# EAGLE design UNO florist automata V1.10 (EAGLE 9.3.1)
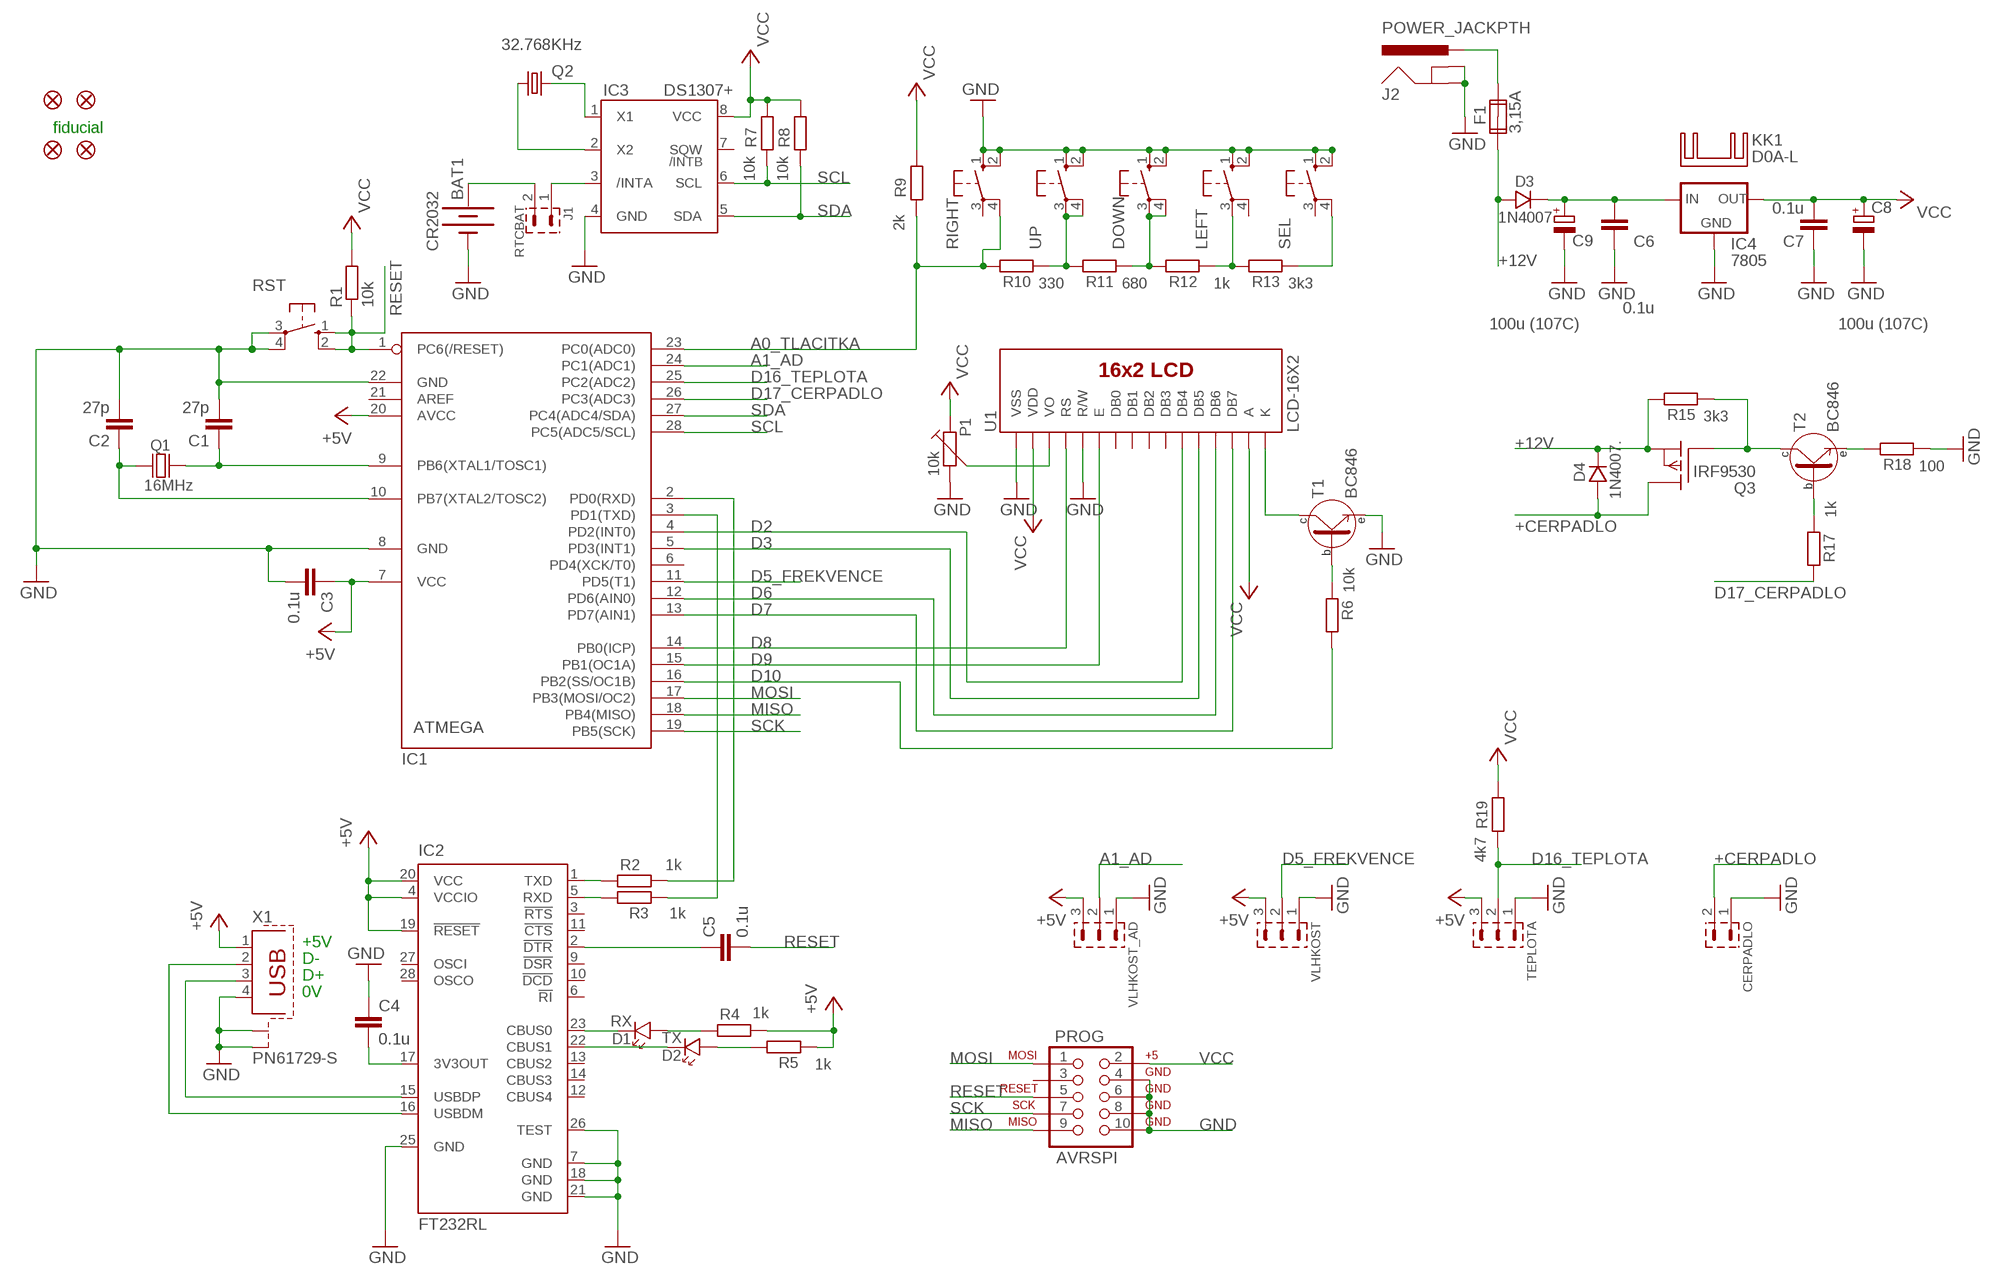
[diagram p0: schematic, sheet 1]

## Parts
BAT1  CR2032  BATTERY20PTH  [BATTCOM_20MM_PTH]
C1  27p  C-EUC1206  [C1206]
C2  27p  C-EUC1206  [C1206]
C3  0.1u  C-EUC1206  [C1206]
C4  0.1u  C-EUC1206  [C1206]
C5  0.1u  C-EUC1206  [C1206]
C6  0.1u  C-EUC1206  [C1206]
C7  0.1u  C-EUC1206  [C1206]
C8  100u (107C)  CPOL-EUC/6032-28W  [C/6032-28W]
C9  100u (107C)  CPOL-EUC/6032-28W  [C/6032-28W]
CERPADLO  PSH02-02P  [PSH02-02P]
D1  RX  LED_1206  [P1206]
D2  TX  LED_1206  [P1206]
D3  1N4007.  [SM-1]
D4  1N4007.  [SM-1]
DOWN  10-XX  [B3F-10XX]
F1  3,15A  FUSE2P  [FUSE1]
FID1  FIDUCIAL1.5X3  [FIDUCIAL-1.5X3]
FID2  FIDUCIAL1.5X3  [FIDUCIAL-1.5X3]
FID3  FIDUCIAL1.5X3  [FIDUCIAL-1.5X3]
FID4  FIDUCIAL1.5X3  [FIDUCIAL-1.5X3]
IC1  ATMEGA  MEGA8-P  [DIL28-3]
IC2  FT232RL  [SSOP28]
IC3  DS1307+  DS1337S+  [SO08]
IC4  7805  78XXL  [78XXL]
J1  RTCBAT  S1G2_JUMP  [S1G2_JUM]
J2  POWER_JACKPTH  [POWER_JACK_PTH]
KK1  D0A-L  [D02A-L]
LEFT  10-XX  [B3F-10XX]
P1  10k  TRIMRPT10V  [PT10V]
PROG  AVRSPI  AVR_SPI_PROG2LOCK  [2X5-SHROUDED_LOCK]
Q1  16MHz  Q_HC-49U  [HC-49U]
Q2  32.768KHz  CRYSTALTC38H  [TC38H]
Q3  IRF9530  [TO220]
R1  10k  R-EU_M1206  [M1206]
R2  1k  R-EU_M1206  [M1206]
R3  1k  R-EU_M1206  [M1206]
R4  1k  R-EU_M1206  [M1206]
R5  1k  R-EU_M1206  [M1206]
R6  10k  R-EU_M1206  [M1206]
R7  10k  R-EU_M1206  [M1206]
R8  10k  R-EU_M1206  [M1206]
R9  2k  R-EU_M1206  [M1206]
R10  330  R-EU_M1206  [M1206]
R11  680  R-EU_M1206  [M1206]
R12  1k  R-EU_M1206  [M1206]
R13  3k3  R-EU_M1206  [M1206]
R15  3k3  R-EU_M1206  [M1206]
R17  1k  R-EU_M1206  [M1206]
R18  100  R-EU_M1206  [M1206]
R19  4k7  R-EU_M1206  [M1206]
RIGHT  10-XX  [B3F-10XX]
RST  10-XX  [B3F-10XX]
SEL  10-XX  [B3F-10XX]
T1  BC846  [SOT-23]
T2  BC846  [SOT-23]
TEPLOTA  PSH02-03P  [PSH02-03P]
U1  LCD-16X2  LCD-16X2NOSILK  [LCD-16X2_NOSILK]
UP  10-XX  [B3F-10XX]
VLHKOST  PSH02-03P  [PSH02-03P]
VLHKOST_AD  PSH02-03P  [PSH02-03P]
X1  PN61729-S  [PN61729-S]

## Nets
+12V: D3.A D4.K F1.1A Q3.3(S) R15.2
+CERPADLO: CERPADLO.2 D4.A Q3.2(D)
A: IC3.2(X2) Q2.1
A0_TLACITKA: IC1.23(PC0(ADC0)) R9.1 R10.2 RIGHT.4(P1)
A1_AD: IC1.24(PC1(ADC1)) VLHKOST_AD.2
D2: IC1.4(PD2(INT0)) U1.11(DB4)
D3: IC1.5(PD3(INT1)) U1.12(DB5)
D5_FREKVENCE: IC1.11(PD5(T1)) VLHKOST.2
D6: IC1.12(PD6(AIN0)) U1.13(DB6)
D7: IC1.13(PD7(AIN1)) U1.14(DB7)
D8: IC1.14(PB0(ICP)) U1.4(RS)
D9: IC1.15(PB1(OC1A)) U1.6(E)
D10: IC1.16(PB2(SS/OC1B)) R6.2
D16_TEPLOTA: IC1.25(PC2(ADC2)) R19.1 TEPLOTA.2
D17_CERPADLO: IC1.26(PC3(ADC3)) R17.2
GND: BAT1.2(-) C1.2 C2.2 C3.2 C4.1 C6.1 C7.1 C8.- C9.- CERPADLO.1 DOWN.1(S) DOWN.2(S1) IC1.8(GND) IC1.22(GND) IC2.7(GND) IC2.18(GND) IC2.21(GND) IC2.25(GND) IC2.26(TEST) IC3.4(GND) IC4.GND J2.GND J2.GNDBREAK LEFT.1(S) LEFT.2(S1) P1.2 PROG.4 PROG.6 PROG.8 PROG.10 R18.1 RIGHT.1(S) RIGHT.2(S1) RST.3(P) RST.4(P1) SEL.1(S) SEL.2(S1) T1.2(E) TEPLOTA.1 U1.1(VSS) U1.5(R/W) UP.1(S) UP.2(S1) VLHKOST.1 VLHKOST_AD.1 X1.4 X1.S1 X1.S2
MISO: IC1.18(PB4(MISO)) PROG.9
MOSI: IC1.17(PB3(MOSI/OC2)) PROG.1
N$1: IC2.16(USBDM) X1.2
N$2: IC2.15(USBDP) X1.3
N$3: C4.2 IC2.17(3V3OUT)
N$4: IC2.1(TXD) R2.1
N$5: IC2.5(RXD) R3.2
N$6: IC1.2(PD0(RXD)) R2.2
N$7: IC1.3(PD1(TXD)) R3.1
N$8: C5.1 IC2.2(!DTR)
N$9: D1.K IC2.23(CBUS0)
N$10: D1.A R4.1
N$11: D2.K IC2.22(CBUS1)
N$12: D2.A R5.2
N$13: BAT1.1(+) J1.2
N$14: IC3.3(/INTA) J1.1
N$15: T1.3(C) U1.16(K)
N$18: R10.1 R11.2 UP.3(P) UP.4(P1)
N$19: DOWN.3(P) DOWN.4(P1) R11.1 R12.2
N$20: LEFT.3(P) R12.1 R13.2
N$21: R13.1 SEL.4(P1)
N$22: F1.2A J2.PWR
N$23: C1.1 IC1.9(PB6(XTAL1/TOSC1)) Q1.2
N$24: C6.2 C9.+ D3.K IC4.IN
N$25: R6.1 T1.1(B)
N$26: C2.1 IC1.10(PB7(XTAL2/TOSC2)) Q1.1
N$27: Q3.1(G) R15.1 T2.3(C)
N$28: R18.2 T2.2(E)
N$29: R17.1 T2.1(B)
N$31: P1.3 U1.3(VO)
Q1: IC3.1(X1) Q2.2
RESET: C5.2 IC1.1(PC6(/RESET)) PROG.5 R1.1 RST.1(S) RST.2(S1)
SCK: IC1.19(PB5(SCK)) PROG.7
SCL: IC1.28(PC5(ADC5/SCL)) IC3.6(SCL) R7.1
SDA: IC1.27(PC4(ADC4/SDA)) IC3.5(SDA) R8.1
VCC: C3.1 C7.2 C8.+ IC1.7(VCC) IC1.20(AVCC) IC2.4(VCCIO) IC2.19(!RESET) IC2.20(VCC) IC3.8(VCC) IC4.OUT P1.1 PROG.2 R1.2 R4.2 R5.1 R7.2 R8.2 R9.2 R19.2 TEPLOTA.3 U1.2(VDD) U1.15(A) VLHKOST.3 VLHKOST_AD.3 X1.1 ; supply symbol labelled +5V
Unconnected: F1.1B F1.2B IC1.6(PD4(XCK/T0)) IC1.21(AREF) IC2.3(!RTS) IC2.6(!RI) IC2.9(!DSR) IC2.10(!DCD) IC2.11(!CTS) IC2.12(CBUS4) IC2.13(CBUS2) IC2.14(CBUS3) IC2.27(OSCI) IC2.28(OSCO) IC3.7(SQW) LEFT.4(P1) PROG.3 RIGHT.3(P) SEL.3(P) U1.7(DB0) U1.8(DB1) U1.9(DB2) U1.10(DB3)

## Notes on the sheet
- fiducial
- +5V
- D-
- D+
- 0V

## Library data of the parts
BAT1 = SparkFun-Electromechanical:BATTERY: Battery Holders Various common sizes : AA, AAA, 18650 (PRT-12895), 20mm coin cell and 12mm coin cell. 20MM_4LEGS, BATT-10373
C1-C7 = rcl:C-EU: CAPACITOR, European symbol
C8 C9 = rcl:CPOL-EU: POLARIZED CAPACITOR, European symbol
CERPADLO = #PaJa_konektory:PSH02-02: Konektory se zamkem - vidlice - 2pin
D1 D2 = #PaJa_31:LED: LED - jednobarevna
D3 D4 = #PaJa_31:1N4007: Usmernovaci dioda - 1A, 1000V
DOWN LEFT RIGHT RST SEL UP = switch-omron-modified:10-XX: OMRON SWITCH
F1 = special:FUSE2P: FUSE 5 x 20 mm
FID1-FID4 = SparkFun-Retired:FIDUCIAL: Fiducial Alignment Points Various fiducial points for machine vision alignment.
IC1 = atmel:MEGA8-P: MICROCONTROLLER 8 Kbytes FLASH, 1 kbytes SRAM, 512 bytes EEPROM, USART, 4-channel 10 bit ADC, 2-channel 8 bit ADC Pin compatible with Atmega48, ATMega88, ATMega168 Source: avr.lbr
IC2 = ftdichip:FT232R: Source: http://www.ftdichip.com/Documents/DataSheets/DS_FT232R_v104.pdf; MPN: FT232RL; OC_FARNELL: 1146032; OC_NEWARK: 91K9918
IC3 = #PaJa_31:DS1337: RTC - obvod realneho casu (ekviv. DS1307)
IC4 = v-reg:78XXL: VOLTAGE REGULATOR
J1 = #PaJa_konektory:S1G2_JUMP: Radove konektory - koliky - 2x
J2 = SparkFun-Connectors:POWER_JACK: Power Jack This is the standard 5.5mm barrel jack for power. The PTH is the most common, proven, reliable, footprint. The Slot footprint only works if the mill layer is transmitted to the PCB fab house so be warned. Mating wall wart : TOL-00298 (and others); PROD_ID: PRT-00119
KK1 = heatsink:D0A-L: HEATSINK distributor Schukat
P1 = #PaJa_31:TRIMR: Trimr
PROG = SparkFun-Connectors:AVR_SPI_PROG2: AVR 10-pin ICSP Header This is the standard AVR In Circuit Serial Programming header. Minimal, but includes pin one indicator. Works with standard Olimex programmers. Also look for the 6-pin reduced version. Spark Fun Electronics SKU: PRT-00778
Q1 = #PaJa_31:Q: Krystal HC-49 - 1MHz - 48MHz DT38 - Quartz (hodinovy) 32,768kHz
Q2 = crystal:CRYSTAL: CRYSTAL; OC_FARNELL: unknown; OC_NEWARK: unknown
Q3 = transistor-fet:IRF9530: P-Channel Enhancement MOSFET (HEXFET); -100V; -12A; 0,3Ohm
R1-R13 R15 R17-R19 = rcl:R-EU_: RESISTOR, European symbol
T1 T2 = #PaJa_31:BC846: SMD tranzistor - NPN - ekv. BC546
TEPLOTA VLHKOST VLHKOST_AD = #PaJa_konektory:PSH02-03: Konektory se zamkem - vidlice - 3pin
U1 = SparkFun-Displays:LCD-16X2: Standard text-only 16x2 parallel input LCD
X1 = con-berg:PN61729-S: BERG USB connector; OC_FARNELL: unknown; OC_NEWARK: unknown

## Board
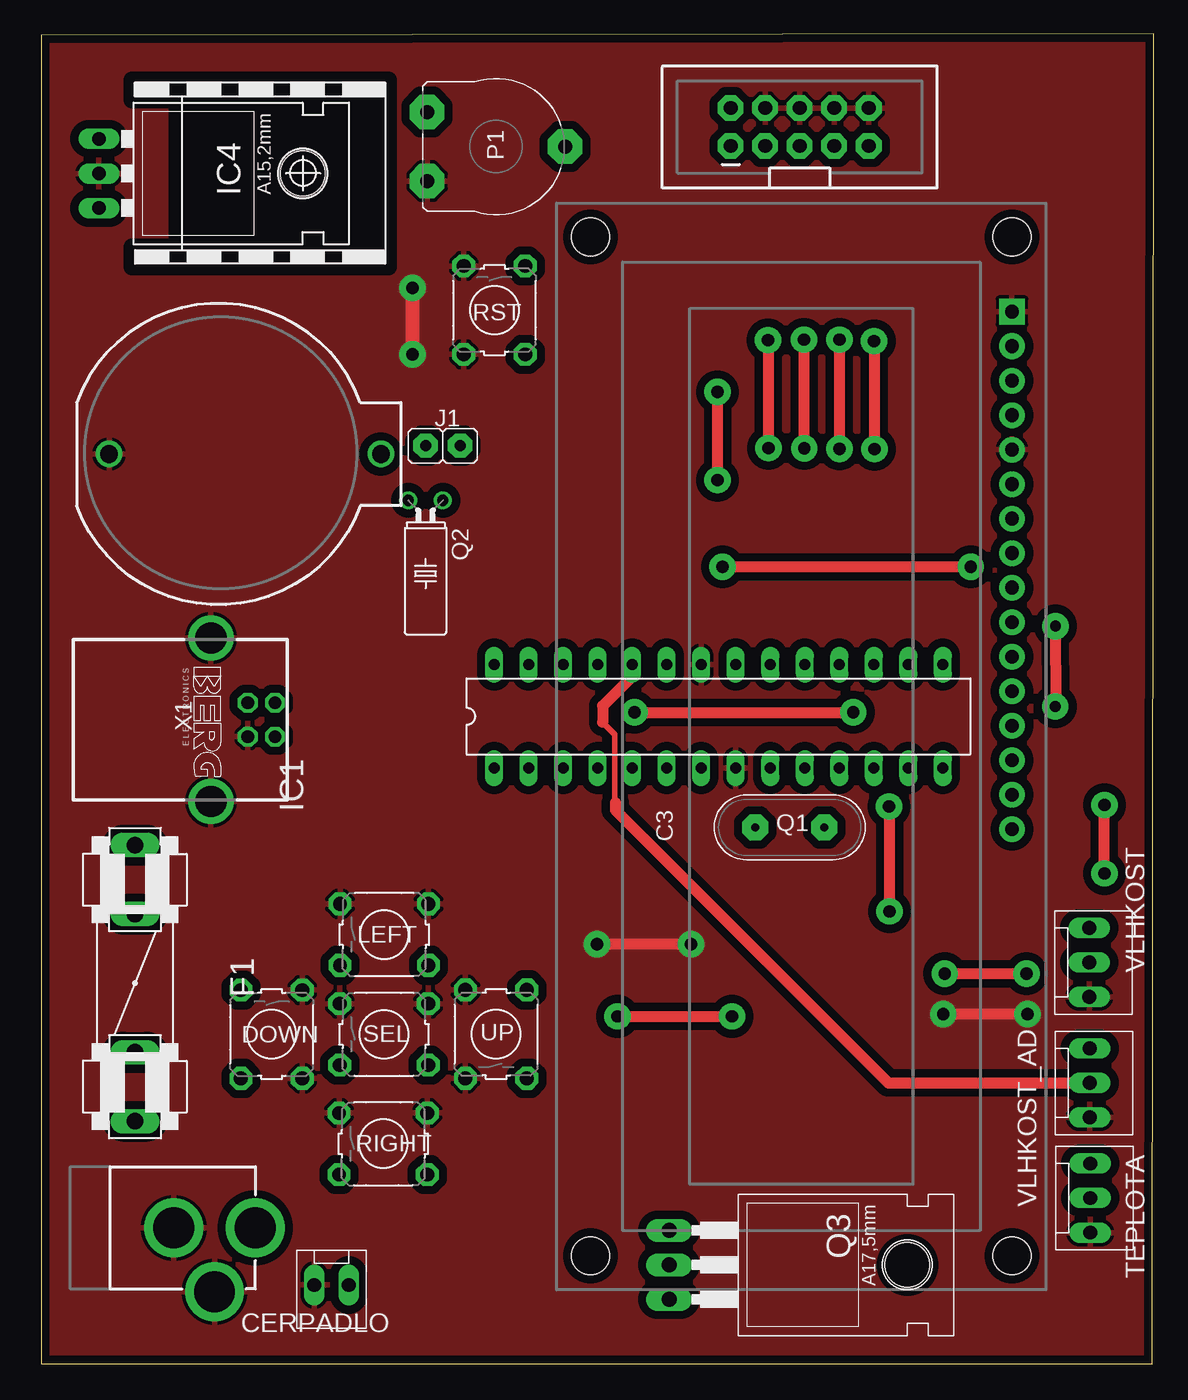
[diagram p1: board, top side]
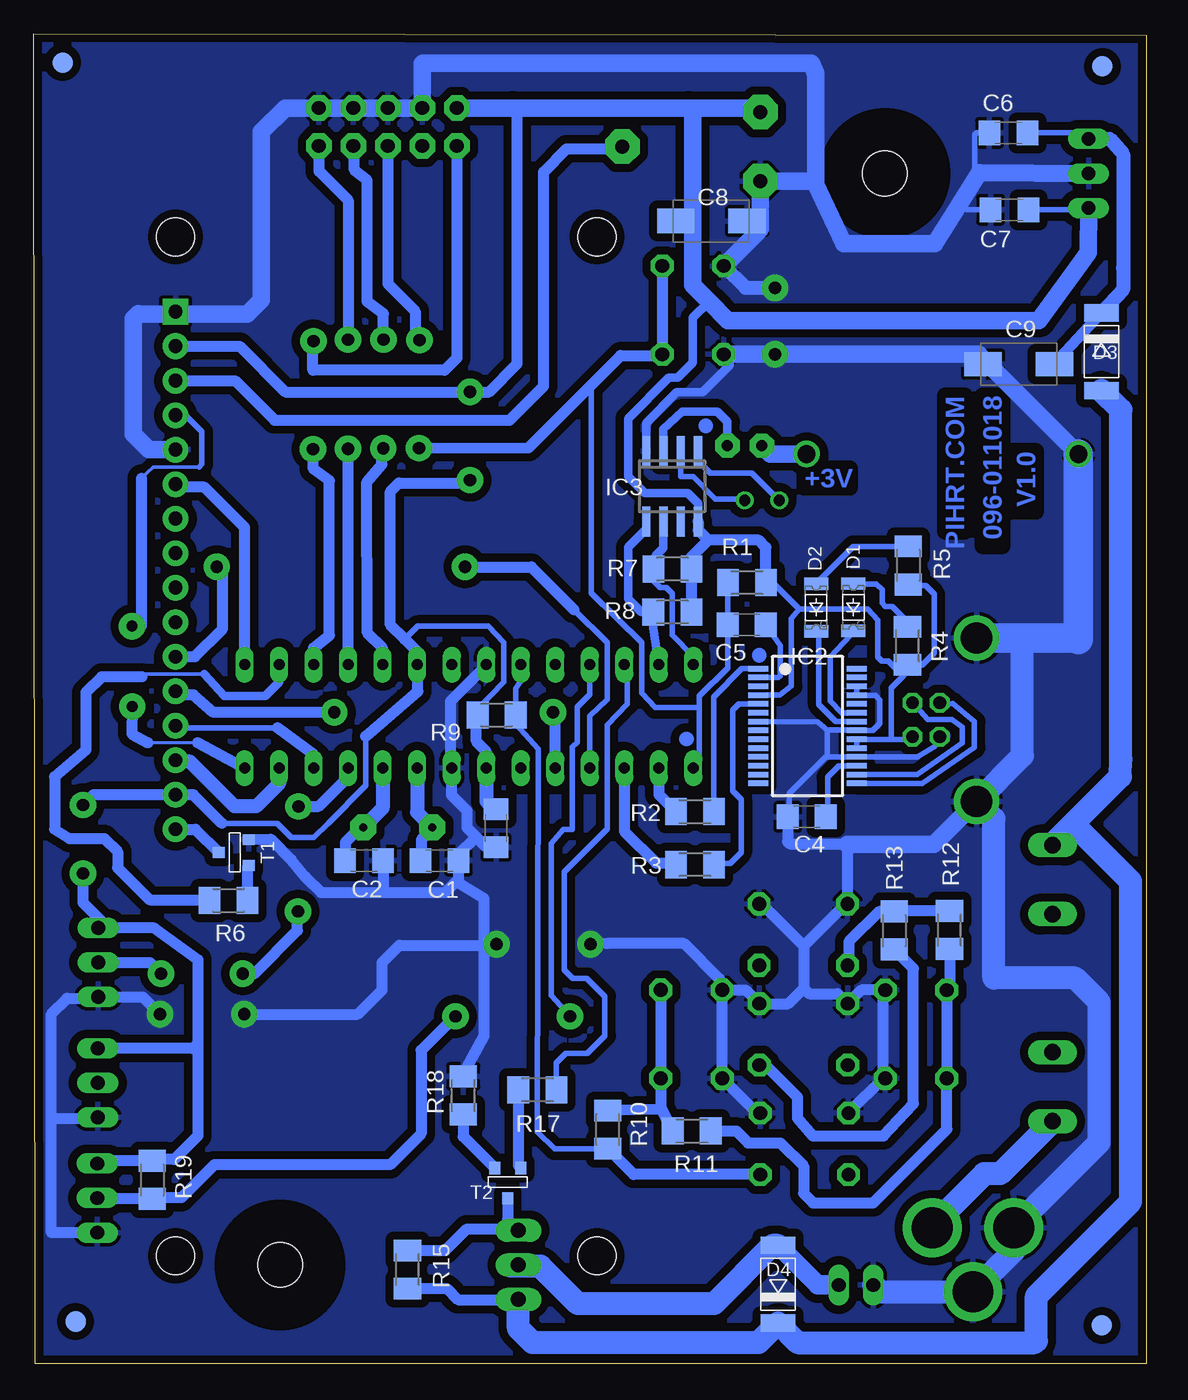
[diagram p2: board, bottom side, seen from below]

Size 81.85 x 97.9 mm. Coordinates in mm from the lower left corner, seen from the top.
Outline: 0.02,0.01 81.76,0 81.85,97.9 0,97.8 0.02,0.01
Copper layers (1*16): Top 0.035mm / dielectric 1.5mm / Bottom 0.035mm
Design rules "default": minimum track width 5mil, minimum drill 12mil, track to track 5mil, track to pad 5mil, pad to pad 5mil, via to via 5mil, smd to smd 0mil, copper to edge 10mil, drill to drill 10mil, minimum pad ring 10mil, minimum via ring 6mil, stop-mask expansion 2mil, vias tented up to drill 25mil, thermal gap 10mil

### Footprints (pad centres in the part's own frame; a part is rotated, then mirrored left to right if it is on the bottom)
BATTCOM_20MM_PTH = drill 1.3: 1 11.85,0; 2 -8.15,0
C1206 = smd 1.6 x 1.8: 1 -1.4,0; 2 1.4,0
C/6032-28W = smd 2.75 x 1.8: + 2.625,0; - -2.625,0
PSH02-02P = drill 1.016 pad 1.422 long: 1 -1.27,0; 2 1.27,0
P1206 = smd 0.914 x 1.778: A -1.905,0; K 1.587,0
SM-1 = smd 1.27 x 2.54: A 2.857,0; K -2.857,0
B3F-10XX = drill 1.016 pad 1.676 octagon: 1 -3.251,2.261; 2 3.251,2.261; 3 -3.251,-2.261; 4 3.251,-2.261
FUSE1 = drill 1.194 long: 1A -10.16,0; 1B -5.08,0; 2A 10.16,0; 2B 5.08,0
FIDUCIAL-1.5X3 = smd 1.5 x 1.5: 1 0,0
DIL28-3 = drill 0.813 long: 1 -16.51,-3.81; 2 -13.97,-3.81; 3 -11.43,-3.81; 4 -8.89,-3.81; 5 -6.35,-3.81; 6 -3.81,-3.81; 7 -1.27,-3.81; 8 1.27,-3.81; 9 3.81,-3.81; 10 6.35,-3.81; 11 8.89,-3.81; 12 11.43,-3.81; 13 13.97,-3.81; 14 16.51,-3.81; 15 16.51,3.81; 16 13.97,3.81; 17 11.43,3.81; 18 8.89,3.81; 19 6.35,3.81; 20 3.81,3.81; 21 1.27,3.81; 22 -1.27,3.81; 23 -3.81,3.81; 24 -6.35,3.81; 25 -8.89,3.81; 26 -11.43,3.81; 27 -13.97,3.81; 28 -16.51,3.81
SSOP28 = smd 0.4 x 1.5: 1 -4.225,-3.625; 2 -3.575,-3.625; 3 -2.925,-3.625; 4 -2.275,-3.625; 5 -1.625,-3.625; 6 -0.975,-3.625; 7 -0.325,-3.625; 8 0.325,-3.625; 9 0.975,-3.625; 10 1.625,-3.625; 11 2.275,-3.625; 12 2.925,-3.625; 13 3.575,-3.625; 14 4.225,-3.625; 15 4.225,3.625; 16 3.575,3.625; 17 2.925,3.625; 18 2.275,3.625; 19 1.625,3.625; 20 0.975,3.625; 21 0.325,3.625; 22 -0.325,3.625; 23 -0.975,3.625; 24 -1.625,3.625; 25 -2.275,3.625; 26 -2.925,3.625; 27 -3.575,3.625; 28 -4.225,3.625
SO08 = smd 0.6 x 2.2: 1 -1.905,-2.6; 2 -0.635,-2.6; 3 0.635,-2.6; 4 1.905,-2.6; 5 1.905,2.6; 6 0.635,2.6; 7 -0.635,2.6; 8 -1.905,2.6
78XXL = drill 1.016 long: GND 0,-3.81; IN -2.54,-3.81; OUT 2.54,-3.81 | hole 3.302: 0,11.176
S1G2_JUM = drill 0.813 pad 1.778 octagon: 1 -1.27,0; 2 1.27,0
POWER_JACK_PTH = drill 2.997 pad 4.318: GND 0,7.7; GNDBREAK 4.7,10.7; PWR 0,13.7
PT10V = drill 1.016 pad 2.54 octagon: 1 -2.54,-5.08; 2 2.54,-5.08; 3 0,5.08
2X5-SHROUDED_LOCK = drill 1.016 pad 1.88 octagon: 1 -1.397,5.08; 2 1.397,5.08; 3 -1.397,2.54; 4 1.397,2.54; 5 -1.397,0; 6 1.397,0; 7 -1.397,-2.54; 8 1.397,-2.54; 9 -1.397,-5.08; 10 1.397,-5.08
HC-49U = drill 0.61 pad 1.93 octagon: 1 -2.54,0; 2 2.54,0
TC38H = drill 0.813: 1 -1.27,0; 2 1.27,0
TO220 = drill 1.118 long: 1 -2.54,-6.35; 2 0,-6.35; 3 2.54,-6.35 | hole 3.302: 0,11.176
M1206 = smd 1.6 x 2: 1 -1.4,0; 2 1.4,0
SOT-23 = smd 0.787 x 0.889: 1 -0.953,-0.953; 2 0.953,-0.953; 3 0,1.27
PSH02-03P = drill 1.016 pad 1.422 long: 1 -2.54,0; 2 0,0; 3 2.54,0
LCD-16X2_NOSILK = drill 1.016 pad 1.88 square: 1 -32,15.5 | drill 1.016 pad 1.88: 2 -29.46,15.5; 3 -26.92,15.5; 4 -24.38,15.5; 5 -21.84,15.5; 6 -19.3,15.5; 7 -16.76,15.5; 8 -14.22,15.5; 9 -11.68,15.5; 10 -9.14,15.5; 11 -6.6,15.5; 12 -4.06,15.5; 13 -1.52,15.5; 14 1.02,15.5; 15 3.56,15.5; 16 6.1,15.5 | hole 2.8: -37.5,15.5; -37.5,-15.5; 37.5,15.5; 37.5,-15.5
PN61729-S = drill 0.95 octagon: 1 1.25,4.71; 2 -1.25,4.71; 3 -1.25,2.71; 4 1.25,2.71 | drill 2.3 pad 2.9: S1 -6.02,0; S2 6.02,0

### Placement (x,y rotation side)
BAT1  13.16,66.97 0 top
C1  52.02,37.05 0 bottom
C2  57.57,37.05 0 bottom
C3  47.86,39.43 270 bottom
C4  25,40.27 0 bottom
C5  29.41,54.41 180 bottom
C6  10.15,90.61 0 bottom
C7  10.07,84.95 0 bottom
C8  32.01,84.13 180 bottom
C9  9.4,73.59 0 bottom
CERPADLO  21.37,5.81 0 top
D1  21.56,55.54 270 bottom
D2  24.3,55.53 270 bottom
D3  3.3,74.51 270 bottom
D4  27.09,5.87 90 bottom
DOWN  16.96,24.27 270 top
F1  6.9,28.03 270 top
FID1  3.24,95.51 0 bottom
FID2  3.28,2.84 0 bottom
FID3  79.75,95.8 0 bottom
FID4  78.79,3.12 0 bottom
IC1  49.84,47.67 0 top
IC2  24.94,46.96 270 bottom
IC3  34.9,64.61 180 bottom
IC4  8.07,87.63 270 top
J1  29.56,67.59 180 top
J2  2.06,10.02 270 top
KK1  13.81,87.64 180 top
LEFT  25.25,31.61 0 top
P1  33.48,89.6 270 top
PROG  55.82,91.05 90 top
Q1  55.08,39.5 180 top
Q2  28.29,63.57 180 top
Q3  52.56,7.3 270 top
R1  29.39,57.51 0 bottom
R2  33.22,40.66 180 bottom
R3  33.22,36.74 0 bottom
R4  17.58,52.86 270 bottom
R5  17.52,58.78 90 bottom
R6  67.54,34.13 180 bottom
R7  34.87,58.52 0 bottom
R8  34.88,55.34 0 bottom
R9  47.81,47.76 180 bottom
R10  39.63,17.26 270 bottom
R11  33.45,17.15 180 bottom
R12  14.49,31.94 270 bottom
R13  18.55,31.91 90 bottom
R15  54.37,6.95 270 bottom
R17  44.81,20.18 0 bottom
R18  50.27,19.77 270 bottom
R19  73.15,13.55 90 bottom
RIGHT  25.17,16.21 0 top
RST  33.36,77.57 270 top
SEL  25.23,24.26 0 top
T1  66.99,37.65 90 bottom
T2  46.99,13.47 180 bottom
TEPLOTA  77.19,12.21 90 top
U1  55.94,45.46 270 top
UP  33.48,24.28 90 top
VLHKOST  77.13,29.55 90 top
VLHKOST_AD  77.16,20.68 90 top
X1  12.5,47.42 270 top

### Tracks (layer width: path | path; a pad name or v marks a point on that pad's centre or on a via)
+12V
  Bottom 0.813: R15.2 51.48,5.55 50.65,4.73 46.24,4.73 Q3.3
  Bottom 1.676: D3.A 1.88,70.23 1.88,44.51 1.92,43.24 5.56,39.6 | 5.56,39.6 6.9,38.26 F1.1A | Q3.3 46.21,2.61 45.15,1.56 28.55,1.56 D4.K 25.64,1.56 8.23,1.56 8.09,1.69 8.09,5 1.15,11.94 1.15,35.52 5.23,39.6 5.56,39.6
+CERPADLO
  Bottom 1.422: CERPADLO.2 24.18,5.81 D4.A
  Bottom 1.676: D4.A 27.52,8.73 31.81,4.44 41.84,4.44 44.59,7.2 46.75,7.2 46.8,7.25 46.25,7.25 Q3.2
A
  Bottom 0.406: Q2.1 29.66,63.67 31.72,63.67 33.35,65.3 34.27,65.3 IC3.2
A0_TLACITKA
  Bottom 0.406: IC1.23 45.84,51.29 45.84,50.53 46.41,49.7 R9.1 46.41,47.12 44.77,45.26 44.81,17.1 43.54,15.83 39.66,15.83 R10.2
  Bottom 0.813: R10.2 37.72,13.94 RIGHT.4
A1_AD
  Top 0.406: 41.32,47.23 42.21,46.34 42.21,41.35 42.25,41.3
  Top 0.813: IC1.24 43.49,50.66 43.52,50.63 41.32,48.43 41.32,47.23 | 42.25,41.3 42.25,40.77 62.34,20.68 VLHKOST_AD.2
D2  (via drill 0.9 pad 1.93)
  Top 0.813: v68.4,58.67 v50.14,58.67
  Bottom 0.406: IC1.4 40.95,47.68 39.67,48.92 39.67,53.12 42.12,55.53
  Bottom 0.813: U1.11 70.02,52.06 67.97,54.1 67.97,58.24 v68.4,58.67 | v50.14,58.67 45.26,58.67 42.12,55.53
D3  (via drill 0.9 pad 1.93)
  Top 0.813: v43.66,47.97 v59.76,47.97
  Bottom 0.813: IC1.5 43.49,47.64 v43.66,47.97 | v59.76,47.97 68.65,47.97 70.12,49.25 71.17,49.25 U1.12
D5_FREKVENCE  (via drill 0.9 pad 1.93)
  Top 0.813: v72.5,28.73 v66.5,28.73 | v62.43,33.31 62.43,41 v62.39,41.04
  Bottom 0.813: VLHKOST.2 73.33,29.55 v72.5,28.73 | v66.5,28.73 65.64,28.73 62.47,31.9 62.47,33.28 v62.43,33.31 | v62.39,41.04 60.9,41.04 58.89,43.05 58.89,43.7 IC1.11
D6
  Bottom 0.406: IC1.12 61.27,44.85 | 63.92,46.83 71.04,46.83 U1.13
  Bottom 0.813: 61.27,44.85 63.92,46.83
D7
  Bottom 1.016: IC1.13 63.81,42.74 65.5,41.05 67.09,41.05 70.37,44.34 71.34,44.34 U1.14
D8  (via drill 0.8 pad 1.93)
  Top 0.813: v74.64,54.3 74.65,48.55 v74.63,48.39
  Bottom 0.254: 69.67,66.03 73.09,66.03 73.95,65.19 | 73.45,45.71 69.82,45.73
  Bottom 0.406: U1.4 70.71,69.84 69.5,68.63 69.5,66.23 69.67,66.03
  Bottom 0.813: 73.95,65.19 73.95,54.34 v74.64,54.3 | v74.63,48.39 74.64,46.37 73.45,45.71 | 69.82,45.73 IC1.14
D9
  Bottom 0.813: IC1.15 66.35,61.58 69.31,64.54 71.22,64.54 U1.6
D10
  Bottom 0.254: 69.31,50.8 73.92,50.8 73.9,50.58
  Bottom 0.61: IC1.16 63.81,50.19 64.84,49.16 67.84,49.16 69.31,50.8
  Bottom 0.813: 73.9,50.58 76.88,50.58 78.03,49.43 78.03,45.2 80.33,43.24 80.33,39.36 79.24,38.67 76.66,38.67 75.7,37.71 75.7,36.53 73.34,34.17 68.97,34.17 R6.2
D16_TEPLOTA  (via drill 0.9 pad 1.93)
  Top 0.813: v42.41,25.59 v50.83,25.59
  Bottom 0.406: IC1.25 40.95,49.26 41.86,48.35 41.86,45.76 42.23,45.41 42.23,39.35 42.89,39.35 43.81,38.31 43.81,27.12 v42.41,25.59
  Bottom 0.813: TEPLOTA.2 77.13,12.15 R19.1 73.06,12.24 71.01,12.24 68.59,14.66 55.64,14.66 53.37,16.94 53.37,23.09 50.87,25.59 v50.83,25.59
D17_CERPADLO
  Bottom 0.406: IC1.26 38.19,51.26 38.19,48.57 39.68,47.02 39.68,39.37 42.84,36.21 42.84,29.02 42.22,28.39 41.18,28.39 39.85,27.06 39.85,24.17 41.14,22.88 42.71,22.88 43.41,22.17 R17.2
GND  (via drill 0.9 pad 1.93)
  Top 0.813: v40.91,30.9 v47.82,30.9 | v72.58,25.74 v66.39,25.74
  Top 1.016: v27.32,79.21 v27.32,74.32
  Bottom 0.406: IC2.26 IC2.25 21.27,49.21 19.92,49.21 19.62,48.88 19.62,47.13 20.12,46.64 IC2.21 21.33,46.65 | X1.4 15.58,45.44 16.85,44.67 20.99,44.67 IC2.18 23.58,44.68 | IC2.7 24.18,47.27 23.45,46.63 21.33,46.65 | 23.58,44.68 26.28,41.98 26.28,40.24 26.28,40.07 26.4,40.07 | 21.33,46.65 23.46,46.65 23.5,46.61 23.5,44.77 23.58,44.68 | C6.1 12.5,90.61 12.64,90.47 12.64,88.04 12.29,87.69 | C7.1 13.2,84.95 13.7,85.44
  Bottom 0.61: IC3.4 36.8,69.27 34.54,71.53 32.65,71.53 30.65,73.53 30.65,73.87 RST.4
  Bottom 0.813: C3.2 48.56,38.03 49.33,38.8 | 49.33,38.8 49.98,39.45 49.98,40.72 51.12,41.86 IC1.8 51.21,43.95 51.21,48.77 48.57,51.4 IC1.22 | 49.33,38.8 50.62,37.51 C1.2 50.6,37.03 50.6,35.68 50.77,35.51 | C4.1 26.31,40.27 26.28,40.24 | 26.4,40.07 26.4,38.43 26.26,38.28 22.07,38.28 22.03,38.25 22.03,33.9 LEFT.1 22.14,33.87 25.23,30.78 | T1.2 64.43,38.63 62.91,37.11 61.89,35.86 60.73,34.7 56.04,34.7 | 56.04,34.7 51.58,34.7 50.77,35.51 | C2.2 56.17,34.83 56.04,34.7 | DOWN.2 19.37,21.02 | 19.37,21.02 RIGHT.1 | RIGHT.2 28.66,18.47 UP.1 | 25.23,30.78 25.23,27.66 | 25.23,27.66 24.82,27.25 22.71,27.25 SEL.1 20.97,27.52 DOWN.1 19.37,27.37 19.37,21.02 | 25.23,27.66 26.36,26.52 SEL.2 29.49,27.53 UP.2 UP.1 | LEFT.2 28.31,33.87 25.23,30.78 | 71.63,77.26 U1.1 | UP.1 31.22,27.57 31.41,27.76 31.41,28.35 34.01,30.94 39.7,30.94 v40.91,30.9 | R18.1 50.27,21.3 48.73,24.14 48.73,30.67 | 48.73,30.67 48.73,30.86 | 48.73,30.86 v47.82,30.9 | 48.73,30.86 48.73,34.25 50.77,35.51 | TEPLOTA.1 80.57,9.67 80.58,9.67 80.58,18.05 | 80.58,18.05 80.58,25.75 79.41,26.91 77.22,26.91 VLHKOST.1 73.84,27.01 v72.58,25.74 | v66.39,25.74 58.03,25.74 56.24,27.53 56.24,29.55 54.97,30.81 48.88,30.81 48.73,30.67 | C9.- 12.21,74.18 | C8.- 28.68,83.24 | VLHKOST_AD.1 77.25,18.05 80.58,18.05
  Bottom 1.016: RST.3 29.48,79.21 v27.32,79.21
  Bottom 1.27: RST.3 28.68,83.24 28.4,83.51 P1.2 28.39,87.08 24.6,87.06 | IC4.GND 12.29,87.69 13.7,85.44 15.55,82.47 22.25,82.47 24.36,86.89 24.6,87.06 | 24.6,87.06 24.32,87.13 24.32,94.98 24.67,95.74 53.26,95.74 53.28,95.72 PROG.4 PROG.6 PROG.8 PROG.10 63.37,92.45 65.12,90.7 65.12,78.3 66.15,77.26 71.63,77.26 74.13,77.26 74.17,77.3 74.54,76.92 74.54,68.43 73.41,67.3 U1.5 | RST.4 v27.32,74.32 12.35,74.32 12.21,74.18 BAT1.2 | X1.S2 15.65,38.25 22.03,38.25
  Bottom 1.676: CERPADLO.1 19.6,5.31 J2.GNDBREAK 9.76,8.31 J2.GND 3.47,16.3 3.47,26.63 5.25,28.41 11.22,28.41 11.22,40.12 X1.S2 9.13,44.77 9.13,53.44
  Bottom 2.184: BAT1.2 5.01,53.31 5.14,53.44 9.13,53.44 X1.S1
  pour Bottom (isolate 0.61): -0.25,98.01 -0.25,0.08 81.61,0.08 81.61,98.01
  pour Top (isolate 0.61): -0.4,98.04 -0.4,-0.1 81.74,-0.1 81.74,98.04
MISO  (via drill 0.9 pad 1.93)
  Top 0.813: v58.74,75.39 v58.74,67.36
  Bottom 0.813: PROG.9 60.86,89.62 60.86,87.78 58.74,85.66 v58.74,75.39 | IC1.18 v58.73,67.35 v58.74,67.36
MOSI  (via drill 0.9 pad 1.93)
  Top 0.813: v61.29,75.29 61.29,67.38 v61.32,67.35
  Bottom 0.813: IC1.17 61.27,52.7 60.12,53.63 60.12,65.01 61.3,65.89 v61.32,67.35 | PROG.1 50.74,74.04 51.64,73.14 61.32,73.14 61.32,74.92 61.31,74.93 61.31,75.27 v61.29,75.29
N$1
  Bottom 0.406: IC2.16 16.85,43.38 13.55,45.7 13.54,46.88 14.34,47.42 16.09,47.43 X1.2
N$2
  Bottom 0.406: IC2.15 16.48,42.73 12.66,45.36 12.66,47.28 14.24,48.63 15.16,48.59 X1.3
N$3
  Bottom 0.406: IC2.17 22.64,44.03 23.46,43.2 23.46,40.34 23.54,40.2
  Bottom 0.813: C4.2 23.54,40.2
N$4
  Bottom 0.406: R2.1 31.82,49.11 29.76,51.19 28.6,51.19 IC2.1
N$5
  Bottom 0.406: IC2.5 29.99,48.58 30.45,48.12 30.45,42.19 29.82,41.56 29.82,37.65 30.64,36.83 31.73,36.83 R3.2
N$6
  Bottom 0.813: IC1.2 35.87,41.91 R2.2
N$7
  Bottom 0.813: IC1.3 38.41,39.2 36.08,36.86 34.74,36.86 R3.1
N$8
  Bottom 0.406: IC2.2 27.09,50.53 26.93,50.65 26.93,52.89 C5.1
N$9
  Bottom 0.406: IC2.23 22.41,47.93 23.26,48.78 23.26,52.05 21.29,54.16 21.06,54.16 D1.K
N$10
  Bottom 0.406: R4.1 17.58,54.64 18.7,55.76 19.2,55.76 19.45,56.01 19.45,57 19.86,57.41 20.77,57.41 D1.A
N$11
  Bottom 0.406: IC2.22 22.85,47.28 24.09,48.53 24.09,54.09 D2.K
N$12
  Bottom 0.406: R5.2 21.56,60.18 D2.A
N$13
  Bottom 1.27: BAT1.1 27.67,66.97 J1.2
N$14
  Bottom 0.61: J1.1 30.83,69.36 31.58,70.11 34.16,70.11 35.53,68.81 35.53,67.27 IC3.3
N$15
  Bottom 0.813: U1.16 69.98,39.36 T1.3
N$18
  Bottom 0.813: UP.4 UP.3 35.73,18.84 R11.2 35.67,18.72 R10.1
N$19
  Bottom 0.813: R12.2 14.49,27.73 DOWN.3 DOWN.4 14.68,21 14.68,17.27 20.1,11.86 24.51,11.86 25.22,12.56 25.22,14.57 26.93,16.27 29.3,16.27 30.18,17.15 R11.1
N$20
  Bottom 0.813: R12.1 18.52,33.34 R13.2 19.67,33.31 21.89,31.09 21.89,29.45 LEFT.3
N$21
  Bottom 0.813: SEL.4 28.04,22 25.69,19.64 25.69,18.1 24.54,16.78 19.35,16.78 17.15,19.15 17.15,29.11 R13.1
N$22
  Bottom 1.676: F1.2A 10.77,14 11.94,14 15.76,10.18 J2.PWR
N$23
  Bottom 0.813: Q1.2 52.54,39.41 53.35,38.59 53.35,37.11 C1.1
  Bottom 1.016: IC1.9 53.65,40.61 Q1.2
N$24
  Bottom 0.406: C6.2 4.7,90.61 IC4.IN
  Bottom 0.813: C9.+ D3.K
  Bottom 1.016: IC4.IN 2.71,90.17 1.71,89.04 1.71,80.69 1.71,79.09 D3.K
N$25
  Bottom 0.813: R6.1 66.14,36.6 T1.1
N$26
  Bottom 0.813: Q1.1 57.84,39.5 58.94,38.4 58.94,37.08 C2.1
  Bottom 1.016: IC1.10 56.19,40.92 Q1.1
N$27
  Bottom 0.813: T2.3 46.99,10.62 Q3.1 46.31,9.94 50,9.94 51.59,8.35 R15.1
N$28
  Bottom 0.813: R18.2 50.27,16.74 T2.2
N$29
  Bottom 0.813: R17.1 46.21,14.59 T2.1
N$31
  Bottom 0.813: U1.3 67.05,72.38 64.14,69.47 46.86,69.47 44.36,71.97 44.36,87.74 42.66,89.44 38.73,89.44 P1.3
Q1
  Bottom 0.406: Q2.2 29.02,65.57 32.1,65.57 32.99,66.45 33.02,66.45 33.02,67.18 IC3.1
RESET  (via drill 0.9 pad 1.93)
  Top 0.813: v53.49,75.36 53.49,67.42 v53.53,67.42
  Bottom 0.406: R1.1 30.79,54.43 C5.2 30.81,51.24 32.89,49.16 32.89,48.2 | 32.89,48.2 32.89,44.3 IC1.1 | 35.72,74.22 38.65,74.22 38.71,74.15 38.8,74.15 40.86,72.09 40.86,56.75 37.14,53.11 37.14,49.39 36.15,48.31 33,48.31 32.89,48.2
  Bottom 0.813: PROG.5 55.82,79.5 53.81,77.49 53.81,75.47 v53.49,75.36 | v53.53,67.42 45.45,67.44 38.69,74.22 35.72,74.22 RST.2 RST.1
SCK  (via drill 0.9 pad 1.93)
  Top 0.813: v56.15,67.39 56.15,74.65 v56.14,75.39
  Bottom 0.813: IC1.19 56.19,52.68 57.33,53.82 57.35,64.92 56.26,66.21 56.26,67.29 v56.15,67.39 | v56.14,75.39 56.14,77.3 57.34,78.21 57.34,87.13 58.28,87.89 58.28,89.58 PROG.7
SCL
  Bottom 0.406: IC1.28 33.33,52.09 34.88,53.64 34.88,56.7 35.34,57.15 35.76,57.15 36.39,57.79 36.39,58.41 R7.1
  Bottom 0.61: IC3.6 35.53,60.06 36.1,59.49 36.1,58.7 R7.1
SDA
  Bottom 0.61: IC3.5 36.8,61.45 38.12,60.13 38.12,56.3 37.16,55.34 R8.1 36.28,54.15 IC1.27
VCC  (via drill 0.9 pad 1.93)
  Top 0.813: v49.77,65.06 v49.77,71.55 | v78.24,36.1 v78.24,41.15
  Bottom 0.406: 18.83,45.98 IC2.20 IC2.19 | 18.83,45.98 17.4,45.98 X1.1 | 17.89,50.64 17.58,50.95 R4.2 16.49,51.46 15.62,52.33 15.62,56.66 16.25,57.28 17.43,57.28 R5.1 | 17.89,50.64 18.78,49.75 18.78,46.03 18.83,45.98 | IC2.4 26.98,49.23 26.13,49.89 26.13,54.87 25.55,55.58 | 25.55,55.58 20.5,55.58 19.75,54.74 19.75,52.04 19.47,51.76 19,51.76 17.89,50.64 | R1.2 27.48,57.51 25.55,55.58 | 57.44,46.19 57.44,42.59 60.2,39.8 61.25,38.75 62.91,38.75 63.97,39.8 68.03,39.8 | 53.6,51.04 IC1.20 53.43,51.7 | C7.2 4.4,84.95 IC4.OUT | R9.2 49.21,48.2 47.3,50.19 47.3,53.09 48.44,54.31 53.62,54.31 54.58,53.35
  Bottom 0.61: IC3.8 32.99,63.33 33.75,64.09 36.91,64.09 38.13,65.31 38.13,69.6 35.13,72.59 34.47,72.59 33.36,73.69 33.36,77 32.17,78.19
  Bottom 0.813: R1.2 27.99,60.1 28.52,60.63 32.26,60.63 | 32.26,60.63 33.49,59.39 33.49,58.54 R7.2 R8.2 | IC3.8 32.99,61.36 32.26,60.63 | 68.03,39.8 70.13,41.9 U1.15 77.49,41.9 v78.24,41.15 | 57.44,46.19 53.6,49.51 53.6,51.04 | U1.2 66.71,74.92 63.35,71.55 v49.77,71.55 48.37,71.55 46.3,73.62 46.3,92.12 46.62,92.45 | IC1.7 48.54,43.89 48.54,45.04 49.3,45.84 49.31,47.66 R9.2 | 53.43,51.7 53.43,52.2 54.58,53.35 55.64,54.41 55.64,64.21 55.01,64.84 50,64.84 v49.77,65.06 | TEPLOTA.3 76.99,14.95 R19.2 73.05,15.05 71.53,15.05 69.79,16.79 69.79,22.21 69.79,23.42 69.79,23.62 | VLHKOST.3 76.38,32.09 | 69.79,23.62 69.79,29.76 72.99,32.09 76.38,32.09 | 76.38,32.09 78.24,33.95 v78.24,36.1 | C8.+ 33.39,83.78 | 69.79,23.62 70.19,23.22 VLHKOST_AD.3
  Bottom 1.016: IC1.7 48.57,41.42 C3.1
  Bottom 1.27: PROG.2 46.62,92.45 33.7,92.45 | 33.7,92.45 28.71,92.45 P1.1 | IC4.OUT 4.27,81.79 7.91,76.81 30.79,76.81 32.17,78.19 33.39,79.41 33.39,83.78 33.39,92.14 33.7,92.45
(copper drawn outside any net)
  shapes: Bottom circle x3

### Text on the board
Bottom: 096-011018 | PIHRT.COM | V1.0 | +3V